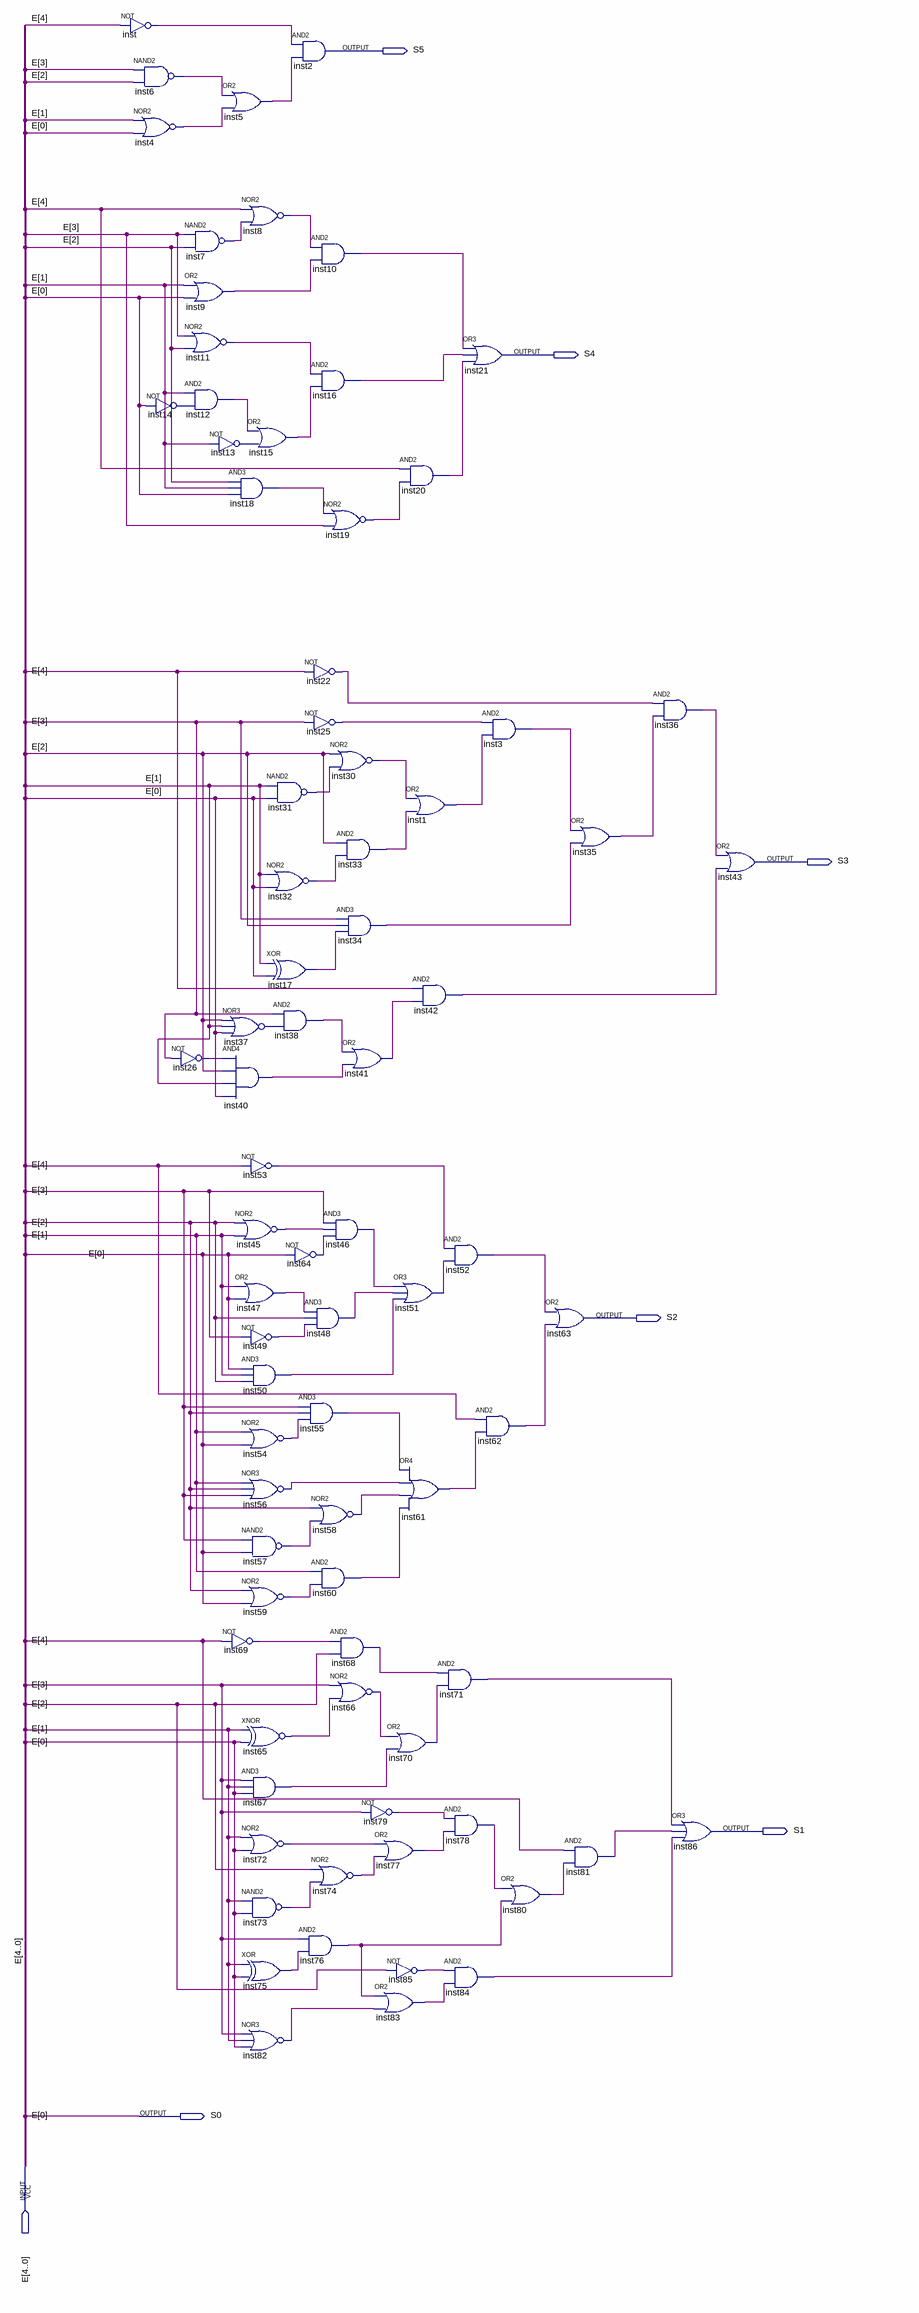
[diagram p0: schematic sheet]
// Quartus schematic SixBitsToBcdNegative.bdf as structural Verilog: 80 symbols, 7 pins
module SixBitsToBcdNegative (
  input  [4:0] E,
  output S5,
  output S4,
  output S3,
  output S2,
  output S1,
  output S0
);

  wire inst1_out, inst3_out, inst4_out, inst5_out, inst6_out, inst7_out, inst8_out, inst9_out, inst10_out,
       inst11_out, inst12_out, inst13_out, inst14_out, inst15_out, inst16_out, inst17_out, inst18_out,
       inst19_out, inst20_out, inst22_out, inst25_out, inst26_out, inst30_out, inst31_out, inst32_out,
       inst33_out, inst34_out, inst35_out, inst36_out, inst37_out, inst38_out, inst40_out, inst41_out,
       inst42_out, inst45_out, inst46_out, inst47_out, inst48_out, inst49_out, inst50_out, inst51_out,
       inst52_out, inst53_out, inst54_out, inst55_out, inst56_out, inst57_out, inst58_out, inst59_out,
       inst60_out, inst61_out, inst62_out, inst64_out, inst65_out, inst66_out, inst67_out, inst68_out,
       inst69_out, inst70_out, inst71_out, inst72_out, inst73_out, inst74_out, inst75_out, inst76_out,
       inst77_out, inst78_out, inst79_out, inst80_out, inst81_out, inst82_out, inst83_out, inst84_out,
       inst85_out, inst_out;

  not inst (inst_out, E[4]);
  nand inst6 (inst6_out, E[3], E[2]);
  nor inst4 (inst4_out, E[1], E[0]);
  not inst14 (inst14_out, E[0]);
  nand inst7 (inst7_out, E[3], E[2]);
  or inst9 (inst9_out, E[1], E[0]);
  nor inst11 (inst11_out, E[3], E[2]);
  and inst12 (inst12_out, E[1], inst14_out);
  not inst13 (inst13_out, E[1]);
  not inst26 (inst26_out, E[3]);
  or inst5 (inst5_out, inst6_out, inst4_out);
  nor inst8 (inst8_out, E[4], inst7_out);
  or inst15 (inst15_out, inst12_out, inst13_out);
  and inst18 (inst18_out, E[2], E[1], E[0]);
  nor inst37 (inst37_out, E[2], E[1], E[0]);
  and inst40 (inst40_out, inst26_out, E[2], E[1], E[0]);
  not inst53 (inst53_out, E[4]);
  nor inst45 (inst45_out, E[2], E[1]);
  or inst47 (inst47_out, E[1], E[0]);
  not inst49 (inst49_out, E[3]);
  and inst50 (inst50_out, E[0], E[1], E[2]);
  nor inst54 (inst54_out, E[1], E[0]);
  nor inst56 (inst56_out, E[1], E[2], E[3]);
  nand inst57 (inst57_out, E[3], E[0]);
  nor inst59 (inst59_out, E[2], E[0]);
  not inst69 (inst69_out, E[4]);
  xnor inst65 (inst65_out, E[1], E[0]);
  and inst67 (inst67_out, E[3], E[1], E[0]);
  nor inst72 (inst72_out, E[1], E[0]);
  nand inst73 (inst73_out, E[1], E[0]);
  xor inst75 (inst75_out, E[1], E[0]);
  nor inst82 (inst82_out, E[3], E[1], E[0]);
  and inst2 (S5, inst_out, inst5_out);
  and inst10 (inst10_out, inst8_out, inst9_out);
  and inst16 (inst16_out, inst11_out, inst15_out);
  not inst22 (inst22_out, E[4]);
  not inst25 (inst25_out, E[3]);
  nand inst31 (inst31_out, E[1], E[0]);
  nor inst32 (inst32_out, E[1], E[0]);
  xor inst17 (inst17_out, E[1], E[0]);
  and inst38 (inst38_out, E[3], inst37_out);
  not inst64 (inst64_out, E[0]);
  and inst48 (inst48_out, inst47_out, E[2], inst49_out);
  and inst55 (inst55_out, E[3], E[2], inst54_out);
  nor inst58 (inst58_out, E[2], inst57_out);
  and inst60 (inst60_out, E[1], inst59_out);
  nor inst74 (inst74_out, E[2], inst73_out);
  and inst76 (inst76_out, E[3], inst75_out);
  nor inst19 (inst19_out, inst18_out, E[3]);
  nor inst30 (inst30_out, E[2], inst31_out);
  and inst33 (inst33_out, E[2], inst32_out);
  and inst34 (inst34_out, E[3], E[2], inst17_out);
  or inst41 (inst41_out, inst38_out, inst40_out);
  and inst46 (inst46_out, E[3], inst45_out, inst64_out);
  and inst68 (inst68_out, inst69_out, E[2]);
  nor inst66 (inst66_out, E[3], inst65_out);
  not inst79 (inst79_out, E[3]);
  and inst20 (inst20_out, E[4], inst19_out);
  or inst1 (inst1_out, inst30_out, inst33_out);
  and inst42 (inst42_out, E[4], inst41_out);
  or inst51 (inst51_out, inst46_out, inst48_out, inst50_out);
  or inst61 (inst61_out, inst55_out, inst56_out, inst58_out, inst60_out);
  or inst70 (inst70_out, inst66_out, inst67_out);
  or inst77 (inst77_out, inst72_out, inst74_out);
  not inst85 (inst85_out, E[2]);
  or inst83 (inst83_out, inst76_out, inst82_out);
  or inst21 (S4, inst10_out, inst16_out, inst20_out);
  and inst52 (inst52_out, inst53_out, inst51_out);
  and inst71 (inst71_out, inst68_out, inst70_out);
  and inst78 (inst78_out, inst79_out, inst77_out);
  and inst84 (inst84_out, inst85_out, inst83_out);
  and inst3 (inst3_out, inst25_out, inst1_out);
  and inst62 (inst62_out, E[4], inst61_out);
  or inst80 (inst80_out, inst78_out, inst76_out);
  or inst63 (S2, inst52_out, inst62_out);
  and inst81 (inst81_out, E[4], inst80_out);
  or inst35 (inst35_out, inst3_out, inst34_out);
  and inst36 (inst36_out, inst22_out, inst35_out);
  or inst43 (S3, inst36_out, inst42_out);
  or inst86 (S1, inst71_out, inst81_out, inst84_out);

  assign S0 = E[0];
endmodule
